# EasyEDA schematic esp32-4-channel.json
TITLE: Sheet_1; REV: 1.0; Date: 2023-02-16; Sheet: 1/1; Company: Your Company
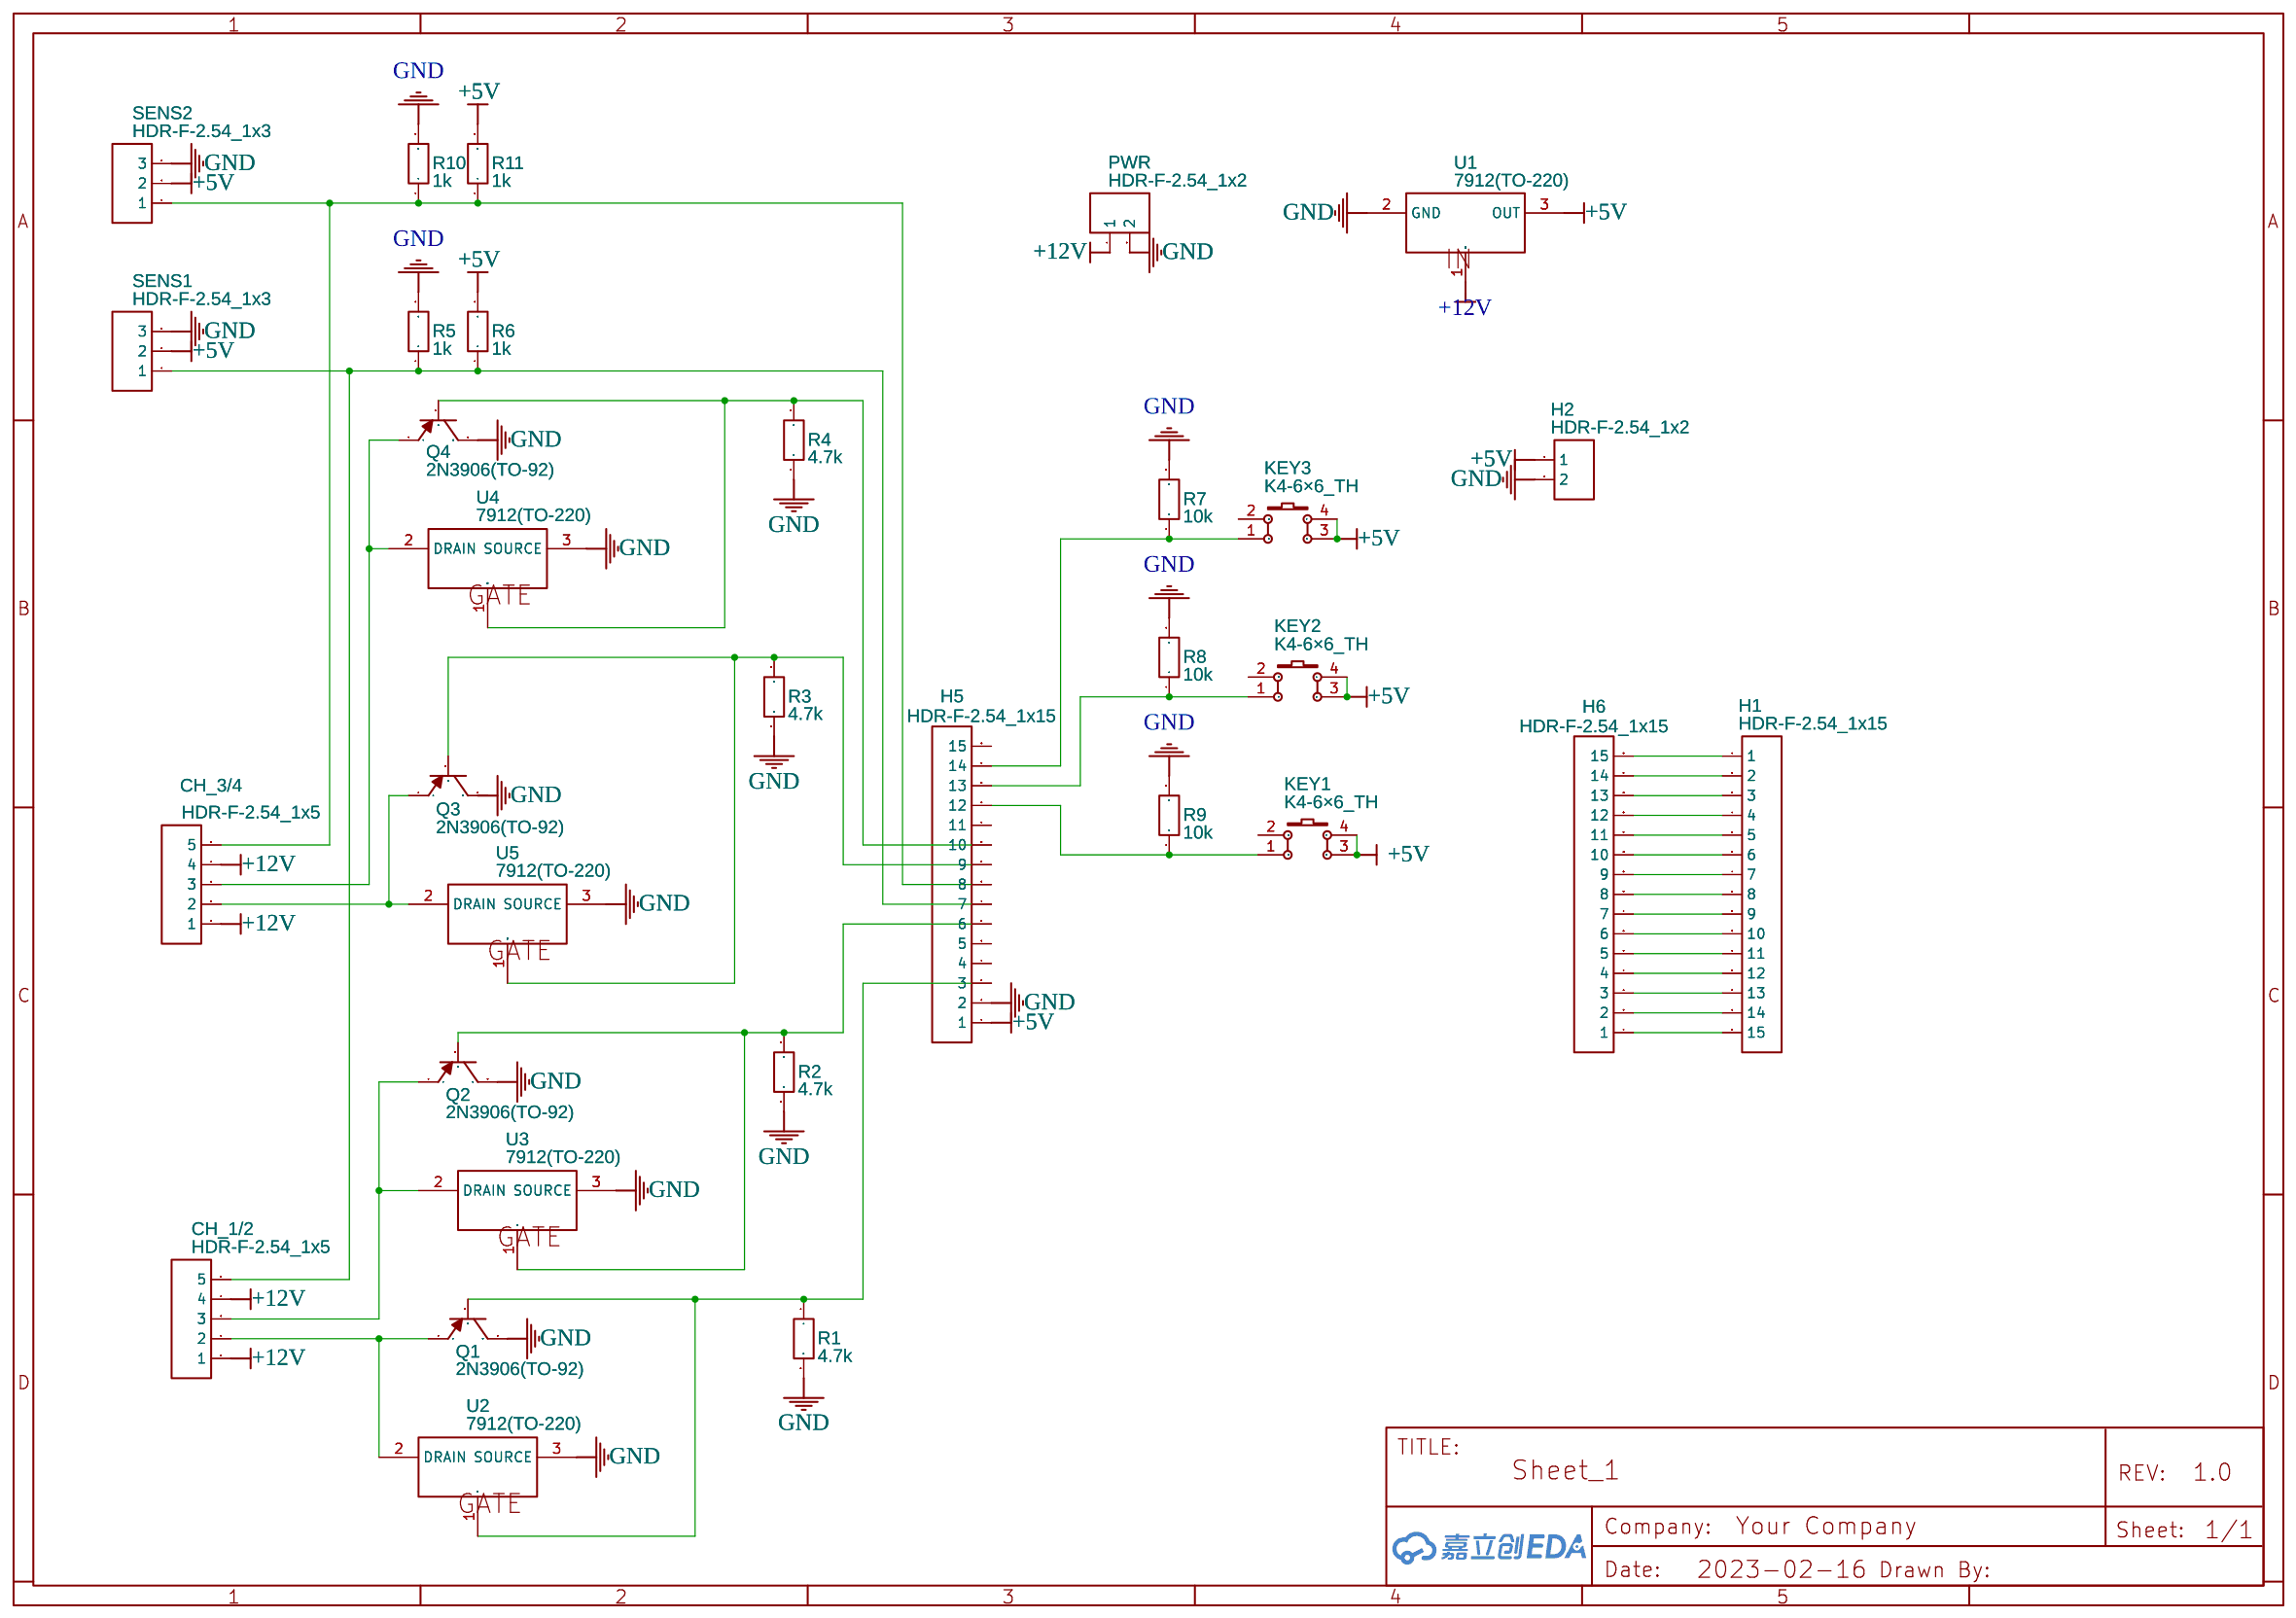
[diagram p0: schematic sheet]

## Parts
CH_1/2  HDR-F-2.54_1x5  [HDR-F-2.54_1X5]
CH_3/4  HDR-F-2.54_1x5  [HDR-F-2.54_1X5]
H1  HDR-F-2.54_1x15  [HDR-F-2.54_1X15]
H2  HDR-F-2.54_1x2  [HDR-F-2.54_1X2]
H5  HDR-F-2.54_1x15  [HDR-F-2.54_1X15]
H6  HDR-F-2.54_1x15  [HDR-F-2.54_1X15]
KEY1  K4-6×6_TH  [KEY-TH_4P-L6.0-W6.0-P4.50-LS6.5]
KEY2  K4-6×6_TH  [KEY-TH_4P-L6.0-W6.0-P4.50-LS6.5]
KEY3  K4-6×6_TH  [KEY-TH_4P-L6.0-W6.0-P4.50-LS6.5]
PWR  HDR-F-2.54_1x2  [HDR-F-2.54_1X2]
Q1  2N3906(TO-92)  [TO-92-3_L4.9-W3.7-P1.27-L]
Q2  2N3906(TO-92)  [TO-92-3_L4.9-W3.7-P1.27-L]
Q3  2N3906(TO-92)  [TO-92-3_L4.9-W3.7-P1.27-L]
Q4  2N3906(TO-92)  [TO-92-3_L4.9-W3.7-P1.27-L]
R1  4.7k  [R_AXIAL-0.3]
R2  4.7k  [R_AXIAL-0.3]
R3  4.7k  [R_AXIAL-0.3]
R4  4.7k  [R_AXIAL-0.3]
R5  1k  [R_AXIAL-0.3]
R6  1k  [R_AXIAL-0.3]
R7  10k  [R_AXIAL-0.3]
R8  10k  [R_AXIAL-0.3]
R9  10k  [R_AXIAL-0.3]
R10  1k  [R_AXIAL-0.3]
R11  1k  [R_AXIAL-0.3]
SENS1  HDR-F-2.54_1x3  [HDR-F-2.54_1X3]
SENS2  HDR-F-2.54_1x3  [HDR-F-2.54_1X3]
U1  7912(TO-220)  [TO-220-3_L10.0-W4.5-P2.54-L]
U2  7912(TO-220)  [TO-220-3_L10.0-W4.5-P2.54-L]
U3  7912(TO-220)  [TO-220-3_L10.0-W4.5-P2.54-L]
U4  7912(TO-220)  [TO-220-3_L10.0-W4.5-P2.54-L]
U5  7912(TO-220)  [TO-220-3_L10.0-W4.5-P2.54-L]

## Library data of the parts
CH_1/2 CH_3/4 = HDR-F-2.54_1x5: Supplier Part: C50950; Supplier: LCSC; Contributor: LCEDA_Lib
H1 H5 H6 = HDR-F-2.54_1x15: Supplier Part: C124408; Supplier: LCSC; Contributor: LCEDA_Lib
H2 PWR = HDR-F-2.54_1x2: Supplier Part: C49661; Supplier: LCSC; Contributor: LCEDA_Lib
KEY1-KEY3 = K4-6×6_TH: Supplier: LCSC; Supplier Part: C136684; Manufacturer: 韩国韩荣; Manufacturer Part: K2-1102DP-E4SW-04; Contributor: LCEDA_Lib
Q1-Q4 = 2N3906(TO-92): Supplier: LCSC; Manufacturer: CJ; Manufacturer Part: 2N3906; Supplier Part: C9809; Contributor: LCEDA_Lib
R1-R11 = R_AXIAL-0.3_EU: Contributor: LCEDA_Lib
SENS1 SENS2 = HDR-F-2.54_1x3: Supplier Part: C146690; Supplier: LCSC; Contributor: LCEDA_Lib
U1-U5 = 7912(TO-220): Supplier: LCSC; Manufacturer: STMicroelectronics; Manufacturer Part: L7912CV-DG; image: //image.lceda.cn/szlcsc/C3797.jpg; Supplier Part: C3797; Contributor: LCEDA_Lib

## Nets
+5V: H2.1 H5.1 KEY1.3 KEY1.4 KEY2.3 KEY2.4 KEY3.3 KEY3.4 R6.2 R11.2 SENS1.2 SENS2.2 U1.3(OUT)
+12V: CH_1/2.1 CH_1/2.4 CH_3/4.1 CH_3/4.4 PWR.1 U1.1(GND)
GND: H2.2 H5.2 PWR.2 Q1.3(C) Q2.3(C) Q3.3(C) Q4.3(C) R1.2 R2.1 R3.1 R4.1 R5.2 R7.2 R8.2 R9.2 R10.2 SENS1.3 SENS2.3 U1.2(GND) U2.3(SOURCE) U3.3(SOURCE) U4.3(SOURCE) U5.3(SOURCE)
Net-(CH_1/2-2): CH_1/2.2 Q1.1(E) U2.2(DRAIN)
Net-(CH_1/2-3): CH_1/2.3 Q2.1(E) U3.2(DRAIN)
Net-(CH_1/2-5): CH_1/2.5 H5.7 R5.1 R6.1 SENS1.1
Net-(CH_3/4-2): CH_3/4.2 Q3.1(E) U5.2(DRAIN)
Net-(CH_3/4-3): CH_3/4.3 Q4.1(E) U4.2(DRAIN)
Net-(CH_3/4-5): CH_3/4.5 H5.8 R10.1 R11.1 SENS2.1
Net-(H1-1): H1.1 H6.15
Net-(H1-2): H1.2 H6.14
Net-(H1-3): H1.3 H6.13
Net-(H1-4): H1.4 H6.12
Net-(H1-5): H1.5 H6.11
Net-(H1-6): H1.6 H6.10
Net-(H1-7): H1.7 H6.9
Net-(H1-8): H1.8 H6.8
Net-(H1-9): H1.9 H6.7
Net-(H1-10): H1.10 H6.6
Net-(H1-11): H1.11 H6.5
Net-(H1-12): H1.12 H6.4
Net-(H1-13): H1.13 H6.3
Net-(H1-14): H1.14 H6.2
Net-(H1-15): H1.15 H6.1
Net-(H5-3): H5.3 Q1.2(B) R1.1 U2.1(GND)
Net-(H5-6): H5.6 Q2.2(B) R2.2 U3.1(GND)
Net-(H5-9): H5.9 Q3.2(B) R3.2 U5.1(GND)
Net-(H5-10): H5.10 Q4.2(B) R4.2 U4.1(GND)
Net-(H5-12): H5.12 KEY1.1 R9.1
Net-(H5-13): H5.13 KEY2.1 R8.1
Net-(H5-14): H5.14 KEY3.1 R7.1

Not connected (* = marked no-connect by the designer): H5 4 5 11 15; KEY1 2; KEY2 2; KEY3 2
